# Altium schematic sheet nerf.SchDoc
size A; SheetNumber: 1; SheetTotal: 1
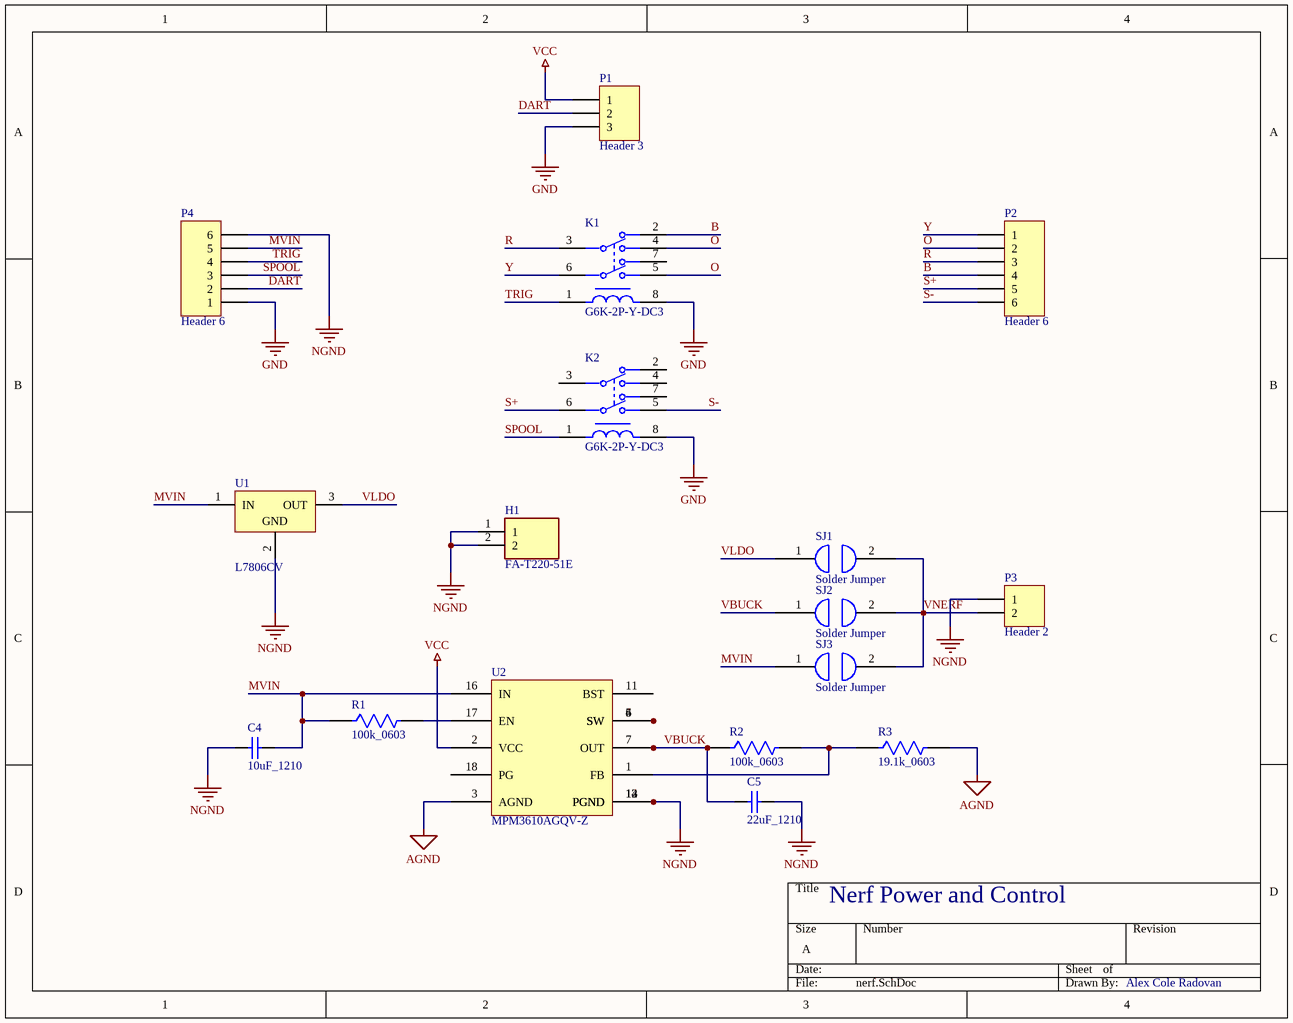
[diagram p0: nerf.SchDoc]

## Parts
C4  10uF_1210  [CAPC3325X28N]
C5  22uF_1210  [CAPC3325X28N]
H1  FA-T220-51E  [FAT22051E]
K1  G6K-2P-Y-DC3  [FP-G6K-2P-Y_DC3-MFG]
K2  G6K-2P-Y-DC3  [FP-G6K-2P-Y_DC3-MFG]
P1  Header 3  [HDR1X3]
P2  Header 6  [HDR1X6]
P3  Header 2  [HDR1X2]
P4  Header 6  [HDR1X6]
R1  100k_0603  [RESC1608X05N]
R2  100k_0603  [RESC1608X05N]
R3  19.1k_0603  [RESC1608X05N]
SJ1  Solder Jumper  [SJ-Footprint]
SJ2  Solder Jumper  [SJ-Footprint]
SJ3  Solder Jumper  [SJ-Footprint]
U1  L7806CV  [TO220]
U2  MPM3610AGQV-Z  [MPM3610AGQV-Z-Footprint-1]

## Nets
AGND: R3.2 U2.3(AGND)
GND: K1.8 K2.8 P1.3 P4.1
NGND: C4.1 C5.2 H1.1 H1.2 P3.1 P4.6 U1.2(GND) U2.12(PGND) U2.13(PGND) U2.14(PGND)
VCC: P1.1 U2.2(VCC)
B: K1.2 P2.4
DART: P1.2 P4.2
MVIN: C4.2 P4.5 R1.1 SJ3.1 U1.1(IN) U2.16(IN)
O: K1.4 K1.5 P2.2
R: K1.3 P2.3
S+: K2.6 P2.5
S-: K2.5 P2.6
SPOOL: K2.1 P4.3
TRIG: K1.1 P4.4
VBUCK: C5.1 R2.1 SJ2.1 U2.7(OUT) U2.8(OUT) U2.9(OUT)
VLDO: SJ1.1 U1.3(OUT)
VNERF: P3.2 SJ1.2 SJ2.2 SJ3.2
Y: K1.6 P2.1
NetR1_2: R1.2 U2.17(EN)
NetR2_2: R2.2 R3.1 U2.1(FB)
NetU2_4: U2.4(SW) U2.5(SW) U2.6(SW)

Not connected (* = marked no-connect by the designer): K1 7; K2 2 3 4 7; U2 11(BST) 18(PG)

## Notes on the sheet
- Nerf Power and Control
- Alex Cole Radovan

## Library data of the parts
C4 = CMP-001-00003-1: 1210 Standard 10uF Ceramic Multilayer Cap; Tolerance: 10%; Voltage Rating: 25V; Dielectric: X7R; Lead Free: Lead Free; Capacitance: 10uF; RoHS Compliant: Yes; Case/Package: 1210
C5 = CMP-001-00002-1: 1210 Standard 22uF Ceramic Multilayer Cap; Tolerance: 10%; Dielectric: X7R; Voltage Rating: 25V; RoHS Compliant: Yes; Lead Free: Lead Free; Capacitance: 22uF; Case/Package: 1210
H1 = FA-T220-51E: Hardware; Manufacturer_Name: Ohmite; Datasheet Link: https://componentsearchengine.com/Datasheets/1/FA-T220-51E.pdf; Height: 50.8mm; Manufacturer_Part_Number: FA-T220-51E
K1 K2 = CMP-00011-1: Relay; E-Mech; Low Signal; DPDT; Cur-Rtg 0.3/1AAC/ADC; Ctrl-V 3DC; Vol-Rtg 125/30AC/DC; Max Voltage Rating (DC): 60V; Max Voltage Rating (AC): 125V; Approvals: UL,CSA; Coil Current: 33mA; Max Current Rating: 1A; Power Consumption: 100mW; Release Time: 3ms; Relay Type: Telecom; Coil Voltage (DC): 3V; Coil Resistance: 91R; Life (Hours): 100000Hour; Coil Type: Non-Latching; Min Operating Temperature: -40°C; Packaging: Rail/Tube; Operate Time: 3ms; Depth: 6.5mm; Max Operating Temperature: 70°C; Case/Package: DIP; Coil Power: 100mW; Height: 5mm; Weight: 0.7g; Throw Configuration: DPDT; Package Quantity: 50; Length: 10mm; Current Rating: 1A; Contact Current Rating: 1A; Termination: PC Pin; Voltage Rating (AC): 125V; Number of Pins: 8; Series: G6K; Mount: PCB,Through Hole; Contact Material: Gold,Silver
P1 = Header 3: Header, 3-Pin; LatestRevisionDate: 17-Jul-2002; LatestRevisionNote: Re-released for DXP Platform.; Publisher: Altium Limited
P2 P4 = Header 6: Header, 6-Pin; LatestRevisionDate: 17-Jul-2002; LatestRevisionNote: Re-released for DXP Platform.; Publisher: Altium Limited
P3 = Header 2: Header, 2-Pin; LatestRevisionDate: 17-Jul-2002; LatestRevisionNote: Re-released for DXP Platform.; Publisher: Altium Limited
R1 R2 = CMP-009-00004-1: Res Thick Film 0603 100K Ohm; Resistance: 100kR; Tolerance: 1%; Power Rating: 100mW; RoHS Compliant: Yes; Lead Free: Lead Free; Case/Package: 0603
R3 = CMP-009-00005-1: 19.1K Ohm; Resistance: 19.1kR; Power Rating: 100mW; Tolerance: 1%; RoHS Compliant: Yes; Lead Free: Lead Free; Case/Package: 0603
SJ1-SJ3 = CMP-00013-3: NO Solder Jumper
U1 = CMP-00016-1: L7806 Series 1.5 A 6 V Three Terminal Voltage Regulator - TO-220; Output Configuration: Positive; Power Supply Rejection Ratio (PSRR): 59dB; Min Output Voltage: 6V; Dropout Voltage: 2V; Max Input Voltage: 35V; Number of Outputs: 1; Output Current: 1.5A; Quiescent Current: 8mA; Min Input Voltage: 8V; Output Type: Fixed; Tolerance: 5%; Mount: Through Hole; Lead Free: Lead Free; Weight: 0.08113oz; Nominal Output Voltage: 6V; REACH SVHC: No SVHC; Width: 4.6mm; Length: 10.4mm; Packaging: Rail/Tube; Radiation Hardening: No; Min Operating Temperature: 0°C; Number of Regulators: 1; Height: 9.15mm; Number of Pins: 3; Max Output Current: 1.5A; Series: -; Polarity: Positive; Package Quantity: 50; Contact Plating: Tin,Matte; Max Operating Temperature: 125°C; Case/Package: TO; Output Voltage: 6V
U2 = CMP-00012-8: MPM3610A Series 21 V 1.2 A Adj. SMT Synchronous Step-Down Converter - QFN-20; Number of Outputs: 1; Voltage - Output 1: 21V; Min Input Voltage: 4.5V; Max Output Current: 600mA; Series: -; Length: 0.2inch; Packaging: Tape and Reel; RoHS Compliant: Yes; Features: UVLO,OCP,OTP; Mount: Surface Mount; Width: 0.12inch; Case/Package: QFN; Max Operating Temperature: 125°C; Lead Free: Lead Free; Height: 0.06inch; Max Input Voltage: 21V; Min Operating Temperature: -40°C